# Altium schematic sheet mackenziemillerschem1.SchDoc
size Tabloid; SheetNumber: 1; SheetTotal: 1
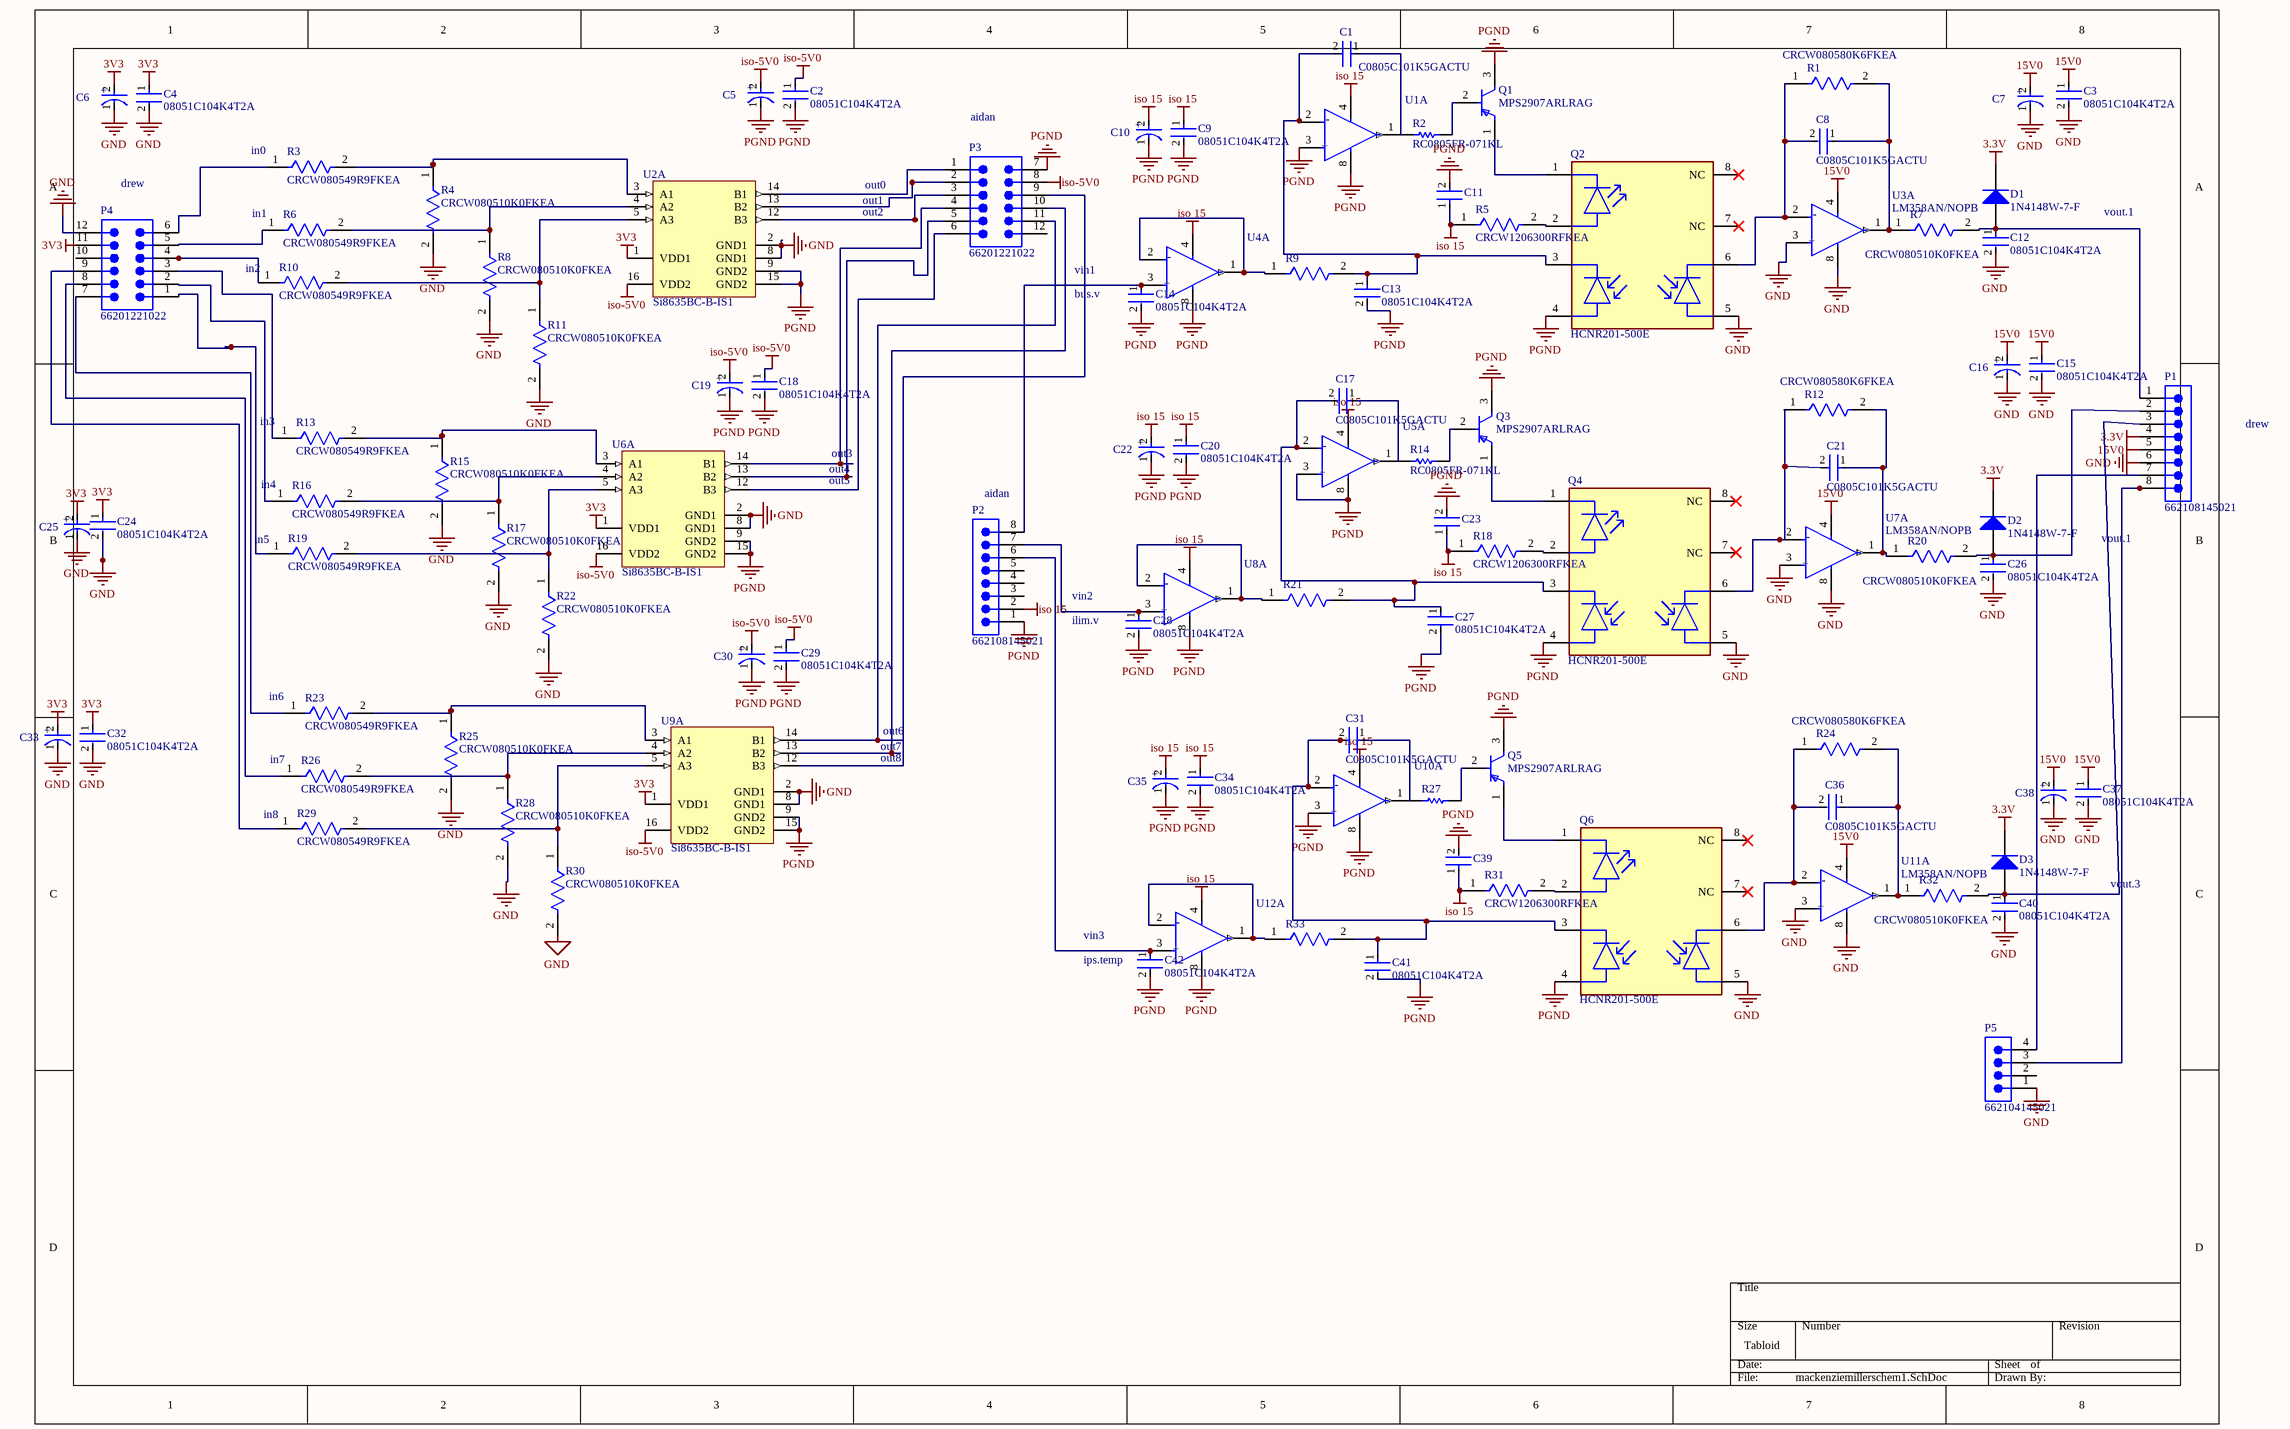
[diagram p0: mackenziemillerschem1.SchDoc]

## Parts
C1  C0805C101K5GACTU  [FP-C0805C-DN-MFG]
C2  08051C104K4T2A  [FP-0805-L_2_01_0_2-W_1_25-IPC_B]
C3  08051C104K4T2A  [FP-0805-L_2_01_0_2-W_1_25-IPC_B]
C4  08051C104K4T2A  [FP-0805-L_2_01_0_2-W_1_25-IPC_B]
C5  293D106X9010B2TE3  [FP-293DB-MFG]  (value not drawn)
C6  293D106X9010B2TE3  [FP-293DB-MFG]  (value not drawn)
C7  293D106X9010B2TE3  [FP-293DB-MFG]  (value not drawn)
C8  C0805C101K5GACTU  [FP-C0805C-DN-MFG]
C9  08051C104K4T2A  [FP-0805-L_2_01_0_2-W_1_25-IPC_B]
C10  293D106X9010B2TE3  [FP-293DB-MFG]  (value not drawn)
C11  08051C104K4T2A  [FP-0805-L_2_01_0_2-W_1_25-IPC_B]  (value not drawn)
C12  08051C104K4T2A  [FP-0805-L_2_01_0_2-W_1_25-IPC_B]
C13  08051C104K4T2A  [FP-0805-L_2_01_0_2-W_1_25-IPC_B]
C14  08051C104K4T2A  [FP-0805-L_2_01_0_2-W_1_25-IPC_B]
C15  08051C104K4T2A  [FP-0805-L_2_01_0_2-W_1_25-IPC_B]
C16  293D106X9010B2TE3  [FP-293DB-MFG]  (value not drawn)
C17  C0805C101K5GACTU  [FP-C0805C-DN-MFG]
C18  08051C104K4T2A  [FP-0805-L_2_01_0_2-W_1_25-IPC_B]
C19  293D106X9010B2TE3  [FP-293DB-MFG]  (value not drawn)
C20  08051C104K4T2A  [FP-0805-L_2_01_0_2-W_1_25-IPC_B]
C21  C0805C101K5GACTU  [FP-C0805C-DN-MFG]
C22  293D106X9010B2TE3  [FP-293DB-MFG]  (value not drawn)
C23  08051C104K4T2A  [FP-0805-L_2_01_0_2-W_1_25-IPC_B]  (value not drawn)
C24  08051C104K4T2A  [FP-0805-L_2_01_0_2-W_1_25-IPC_B]
C25  293D106X9010B2TE3  [FP-293DB-MFG]  (value not drawn)
C26  08051C104K4T2A  [FP-0805-L_2_01_0_2-W_1_25-IPC_B]
C27  08051C104K4T2A  [FP-0805-L_2_01_0_2-W_1_25-IPC_B]
C28  08051C104K4T2A  [FP-0805-L_2_01_0_2-W_1_25-IPC_B]
C29  08051C104K4T2A  [FP-0805-L_2_01_0_2-W_1_25-IPC_B]
C30  293D106X9010B2TE3  [FP-293DB-MFG]  (value not drawn)
C31  C0805C101K5GACTU  [FP-C0805C-DN-MFG]
C32  08051C104K4T2A  [FP-0805-L_2_01_0_2-W_1_25-IPC_B]
C33  293D106X9010B2TE3  [FP-293DB-MFG]  (value not drawn)
C34  08051C104K4T2A  [FP-0805-L_2_01_0_2-W_1_25-IPC_B]
C35  293D106X9010B2TE3  [FP-293DB-MFG]  (value not drawn)
C36  C0805C101K5GACTU  [FP-C0805C-DN-MFG]
C37  08051C104K4T2A  [FP-0805-L_2_01_0_2-W_1_25-IPC_B]
C38  293D106X9010B2TE3  [FP-293DB-MFG]  (value not drawn)
C39  08051C104K4T2A  [FP-0805-L_2_01_0_2-W_1_25-IPC_B]  (value not drawn)
C40  08051C104K4T2A  [FP-0805-L_2_01_0_2-W_1_25-IPC_B]
C41  08051C104K4T2A  [FP-0805-L_2_01_0_2-W_1_25-IPC_B]
C42  08051C104K4T2A  [FP-0805-L_2_01_0_2-W_1_25-IPC_B]
D1  1N4148W-7-F  [DIOD-SOD123-2_V]
D2  1N4148W-7-F  [DIOD-SOD123-2_V]
D3  1N4148W-7-F  [DIOD-SOD123-2_V]
P1  662108145021  [662108145021]
P2  662108145021  [662108145021]
P3  66201221022  [66201221022]
P4  66201221022  [66201221022]
P5  662104145021  [662104145021]
Q1  MPS2907ARLRAG  [FP-29-11-MFG]
Q2  HCNR201-500E  [FP-HCNR201-500E-MFG]
Q3  MPS2907ARLRAG  [FP-29-11-MFG]
Q4  HCNR201-500E  [FP-HCNR201-500E-MFG]
Q5  MPS2907ARLRAG  [FP-29-11-MFG]
Q6  HCNR201-500E  [FP-HCNR201-500E-MFG]
R1  CRCW080580K6FKEA  [FP-CRCW0805-e3-IPC_A]
R2  RC0805FR-071KL  [RESC2013X60X35ML10T20]
R3  CRCW080549R9FKEA  [FP-CRCW0805-e3-MFG]
R4  CRCW080510K0FKEA  [FP-CRCW0805-e3-IPC_A]
R5  CRCW1206300RFKEA  [FP-CRCW1206-e3-IPC_A]
R6  CRCW080549R9FKEA  [FP-CRCW0805-e3-MFG]
R7  CRCW080510K0FKEA  [FP-CRCW0805-e3-IPC_A]
R8  CRCW080510K0FKEA  [FP-CRCW0805-e3-IPC_A]
R9  CRCW080580K6FKEA  [FP-CRCW0805-e3-IPC_A]  (value not drawn)
R10  CRCW080549R9FKEA  [FP-CRCW0805-e3-MFG]
R11  CRCW080510K0FKEA  [FP-CRCW0805-e3-IPC_A]
R12  CRCW080580K6FKEA  [FP-CRCW0805-e3-IPC_A]
R13  CRCW080549R9FKEA  [FP-CRCW0805-e3-MFG]
R14  RC0805FR-071KL  [RESC2013X60X35ML10T20]
R15  CRCW080510K0FKEA  [FP-CRCW0805-e3-IPC_A]
R16  CRCW080549R9FKEA  [FP-CRCW0805-e3-MFG]
R17  CRCW080510K0FKEA  [FP-CRCW0805-e3-IPC_A]
R18  CRCW1206300RFKEA  [FP-CRCW1206-e3-IPC_A]
R19  CRCW080549R9FKEA  [FP-CRCW0805-e3-MFG]
R20  CRCW080510K0FKEA  [FP-CRCW0805-e3-IPC_A]
R21  CRCW080580K6FKEA  [FP-CRCW0805-e3-IPC_A]  (value not drawn)
R22  CRCW080510K0FKEA  [FP-CRCW0805-e3-IPC_A]
R23  CRCW080549R9FKEA  [FP-CRCW0805-e3-MFG]
R24  CRCW080580K6FKEA  [FP-CRCW0805-e3-IPC_A]
R25  CRCW080510K0FKEA  [FP-CRCW0805-e3-IPC_A]
R26  CRCW080549R9FKEA  [FP-CRCW0805-e3-MFG]
R27  RC0805FR-071KL  [RESC2013X60X35ML10T20]  (value not drawn)
R28  CRCW080510K0FKEA  [FP-CRCW0805-e3-IPC_A]
R29  CRCW080549R9FKEA  [FP-CRCW0805-e3-MFG]
R30  CRCW080510K0FKEA  [FP-CRCW0805-e3-IPC_A]
R31  CRCW1206300RFKEA  [FP-CRCW1206-e3-IPC_A]
R32  CRCW080510K0FKEA  [FP-CRCW0805-e3-IPC_A]
R33  CRCW080580K6FKEA  [FP-CRCW0805-e3-IPC_A]  (value not drawn)
U1  LM358AN/NOPB  [FP-P0008A-MFG]  (value not drawn)  (part A of 2)
U2  Si8635BC-B-IS1  [SLAB-SOIC-16-NB_L]  (part A of 2)
U3  LM358AN/NOPB  [FP-P0008A-MFG]  (part A of 2)
U4  LM358AN/NOPB  [FP-P0008A-MFG]  (value not drawn)  (part A of 2)
U5  LM358AN/NOPB  [FP-P0008A-MFG]  (value not drawn)  (part A of 2)
U6  Si8635BC-B-IS1  [SLAB-SOIC-16-NB_L]  (part A of 2)
U7  LM358AN/NOPB  [FP-P0008A-MFG]  (part A of 2)
U8  LM358AN/NOPB  [FP-P0008A-MFG]  (value not drawn)  (part A of 2)
U9  Si8635BC-B-IS1  [SLAB-SOIC-16-NB_L]  (part A of 2)
U10  LM358AN/NOPB  [FP-P0008A-MFG]  (value not drawn)  (part A of 2)
U11  LM358AN/NOPB  [FP-P0008A-MFG]  (part A of 2)
U12  LM358AN/NOPB  [FP-P0008A-MFG]  (value not drawn)  (part A of 2)

## Nets
3.3V: D1.2(K) D2.2(K) D3.2(K) P1.4
3V3: C4.1 C6.2(A) C24.1 C25.2(A) C32.1 C33.2(A) U2.1(VDD1) U6.1(VDD1) U9.1(VDD1)
15V0: C3.1 C7.2(A) C15.1 C16.2(A) C37.1 C38.2(A) P1.5 U3.4(GND) U7.4(GND) U11.4(GND)
GND: C3.2 C4.2 C6.1(C) C7.1(C) C12.2 C15.2 C16.1(C) C24.2 C25.1(C) C26.2 C32.2 C33.1(C) C37.2 C38.1(C) C40.2 P1.6 P4.12 P5.1 Q2.5(PD2_ANODE) Q4.5(PD2_ANODE) Q6.5(PD2_ANODE) R4.2 R8.2 R11.2 R15.2 R17.2 R22.2 R25.2 R28.2 R30.2 U2.2(GND1) U2.8(GND1) U3.3(NON-INVERTING_INPUT_A) U3.8(V+) U6.2(GND1) U6.8(GND1) U7.3(NON-INVERTING_INPUT_A) U7.8(V+) U9.2(GND1) U9.8(GND1) U11.3(NON-INVERTING_INPUT_A) U11.8(V+)
iso 15: C9.1 C10.2(A) C11.1 C20.1 C22.2(A) C23.1 C34.1 C35.2(A) C39.1 P2.2 R5.1 R18.1 R31.1 U1.4(GND) U4.4(GND) U5.4(GND) U8.4(GND) U10.4(GND) U12.4(GND)
iso-5V0: C2.1 C5.2(A) C18.1 C19.2(A) C29.1 C30.2(A) P3.8 U2.16(VDD2) U6.16(VDD2) U9.16(VDD2)
PGND: C2.2 C5.1(C) C9.2 C10.1(C) C11.2 C13.2 C14.2 C18.2 C19.1(C) C20.2 C22.1(C) C23.2 C27.2 C28.2 C29.2 C30.1(C) C34.2 C35.1(C) C39.2 C41.2 C42.2 P2.1 P3.7 Q1.3(C) Q2.4(PD1_ANODE) Q3.3(C) Q4.4(PD1_ANODE) Q5.3(C) Q6.4(PD1_ANODE) U1.3(NON-INVERTING_INPUT_A) U1.8(V+) U2.9(GND2) U2.15(GND2) U4.8(V+) U5.3(NON-INVERTING_INPUT_A) U5.8(V+) U6.9(GND2) U6.15(GND2) U8.8(V+) U9.9(GND2) U9.15(GND2) U10.3(NON-INVERTING_INPUT_A) U10.8(V+) U12.8(V+)
NetC1_1: C1.1 R2.1
NetC1_2: C1.2 C13.1 Q2.3(PD1_CATHODE) R9.2 U1.2(INVERTING_INPUT_A)
NetC8_1: C8.1 R1.2 R7.1 U3.1(OUTPUT_A)
NetC8_2: C8.2 Q2.6(PD2_CATHODE) R1.1 U3.2(INVERTING_INPUT_A)
NetC12_1: C12.1 D1.1(A) P1.1 R7.2
NetC14_1: C14.1 P2.8 U4.3(NON-INVERTING_INPUT_A)
NetC17_1: C17.1 R14.1
NetC17_2: C17.2 C27.1 Q4.3(PD1_CATHODE) R21.2 U5.2(INVERTING_INPUT_A)
NetC21_1: C21.1 R12.2 R20.1 U7.1(OUTPUT_A)
NetC21_2: C21.2 Q4.6(PD2_CATHODE) R12.1 U7.2(INVERTING_INPUT_A)
NetC26_1: C26.1 D2.1(A) P1.2 R20.2
NetC28_1: C28.1 P2.7 U8.3(NON-INVERTING_INPUT_A)
NetC31_1: C31.1 R27.1
NetC31_2: C31.2 C41.1 Q6.3(PD1_CATHODE) R33.2 U10.2(INVERTING_INPUT_A)
NetC36_1: C36.1 R24.2 R32.1 U11.1(OUTPUT_A)
NetC36_2: C36.2 Q6.6(PD2_CATHODE) R24.1 U11.2(INVERTING_INPUT_A)
NetC40_1: C40.1 D3.1(A) P1.3 R32.2
NetC42_1: C42.1 P2.6 U12.3(NON-INVERTING_INPUT_A)
NetP1_7: P1.7 P5.4
NetP1_8: P1.8 P5.3
NetP3_1: P3.1 U2.14(B1)
NetP3_2: P3.2 U2.13(B2)
NetP3_3: P3.3 U2.12(B3)
NetP3_4: P3.4 U6.14(B1)
NetP3_5: P3.5 U6.13(B2)
NetP3_6: P3.6 U6.12(B3)
NetP3_9: P3.9 U9.12(B3)
NetP3_10: P3.10 U9.13(B2)
NetP3_11: P3.11 U9.14(B1)
NetP4_1: P4.1 R19.1
NetP4_2: P4.2 R16.1
NetP4_3: P4.3 R13.1
NetP4_4: P4.4 R10.1
NetP4_5: P4.5 R6.1
NetP4_6: P4.6 R3.1
NetP4_7: P4.7 R23.1
NetP4_8: P4.8 R26.1
NetP4_9: P4.9 R29.1
NetQ1_1: Q1.1(E) Q2.1(LED_CATHODE)
NetQ1_2: Q1.2(B) R2.2
NetQ2_2: Q2.2(LED_ANODE) R5.2
NetQ3_1: Q3.1(E) Q4.1(LED_CATHODE)
NetQ3_2: Q3.2(B) R14.2
NetQ4_2: Q4.2(LED_ANODE) R18.2
NetQ5_1: Q5.1(E) Q6.1(LED_CATHODE)
NetQ5_2: Q5.2(B) R27.2
NetQ6_2: Q6.2(LED_ANODE) R31.2
NetR3_2: R3.2 R4.1 U2.3(A1)
NetR6_2: R6.2 R8.1 U2.4(A2)
NetR9_1: R9.1 U4.1(OUTPUT_A) U4.2(INVERTING_INPUT_A)
NetR10_2: R10.2 R11.1 U2.5(A3)
NetR13_2: R13.2 R15.1 U6.3(A1)
NetR16_2: R16.2 R17.1 U6.4(A2)
NetR19_2: R19.2 R22.1 U6.5(A3)
NetR21_1: R21.1 U8.1(OUTPUT_A) U8.2(INVERTING_INPUT_A)
NetR23_2: R23.2 R25.1 U9.3(A1)
NetR26_2: R26.2 R28.1 U9.4(A2)
NetR29_2: R29.2 R30.1 U9.5(A3)
NetR33_1: R33.1 U12.1(OUTPUT_A) U12.2(INVERTING_INPUT_A)

Not connected (* = marked no-connect by the designer): P2 3 4 5; P3 12; P4 10 11; P5 2; Q2 7(NC)* 8(NC)*; Q4 7(NC)* 8(NC)*; Q6 7(NC)* 8(NC)*; U1 1(OUTPUT_A); U5 1(OUTPUT_A); U10 1(OUTPUT_A)

## Notes on the sheet
- (near R3) in0
- (near P3) aidan
- (near P4) drew
- (near R6) in1
- out1
- out2
- out0
- vout.1
- (near R10) in2
- vin1
- (near C14) bus.v
- (near R13) in3
- out4
- out5
- out3
- drew
- (near R19) in5
- (near R16) in4
- (near P2) aidan
- vin2
- (near C28) ilim.v
- (near R23) in6
- out6
- (near R26) in7
- out7
- out8
- (near R29) in8
- vout.3
- vin3
- (near C42) ips.temp
- Labels drawn without touching a wire or pin: 3V3
- (in symbol CMP-02414-000013-1) +
- (in symbol CMP-04895-000025-1, part A) -; +

## Library data of the parts
C1 C8 C17 C21 C31 C36 = CMP-03020-021029-1: CAP CER 100PF 50V C0G/NP0 0805; Manufacturer: KEMET; Temperature Coefficient: 30ppm/°C; Material: Ceramic; Tolerance: 0.1; Temperature Characteristic: C0G; Capacitance: 100 pF; Category: Cap; Mouser Description: Multilayer Ceramic Capacitors MLCC - SMD/SMT 50volts 100pF C0G 10%; Device Class L2: Capacitors; ComponentLink2URL: https://content.kemet.com/datasheets/KEM_C1003_C0G_SMD.pdf; RoHS: TRUE; Temperature Range Low: -55°C; Ipc Land Pattern Name: CAPC200125X78; Temperature Range High: +125°C; Manufacturer Part Number: C0805C101K5GACTU; Voltage Rating: 50 V; Device Class L1: Passive Components; Lead Free: Yes; Value: 100 pF; Device Class L3: Ceramic Capacitors; Digikey Description: CAP CER 100PF 50V C0G/NP0 0805; Octopart: https://octopart.com/c0805c101k5gactu-kemet-109877; Temperature: -55°C to +125°C; Automotive: No; Height: 0.88mm; Package: C0805C-DN; ComponentLink2Description: Datasheet
C2-C4 C9 C11-C15 C18 C20 C23 C24 C26-C29 C32 C34 C37 C39-C42 = CMP-2007-04172-2: Automotive Ceramic Capacitor, 0805, 100nF, 10%, X7R, 15%, 100V; Voltage Rating (DC): 100V; Case Code (Metric): 2012; Mount: Surface Mount; Length: 2.01mm; Depth: 1.25mm; Lead Free: Lead Free; Ratings: AEC-Q200; Max Operating Temperature: 125°C; Tolerance: 10%; Case/Package: 0805; Width: 0.049inch; Package Quantity: 1; Thickness: 0.055inch; Construction: Flat; Min Operating Temperature: -55°C; REACH SVHC: No SVHC; Number of Pins: 2; Radiation Hardening: No; Capacitance: 100nF; Voltage Rating: 100V; Height: 1.4mm; Series: -; Voltage: 100V; Dielectric: X7R; Termination: SMD/SMT; Case Code (Imperial): 0805; RoHS Compliant: Yes; Packaging: Tape and Reel; Dielectric Material: Ceramic
C5-C7 C10 C16 C19 C22 C25 C30 C33 C35 C38 = CMP-02414-000013-1: CAP TANT 10UF 10% 10V 1411; Leakage Current: 1uA; Q Factor: 6; Ripple Current: 150mA; ESR (Equivalent Series Resistance): 2.5R; Polarity: Polar; Dissipation Factor: 6%; Dielectric Material: Tantalum; Package Quantity: 2000; Features: General Purpose; Voltage: 10V; Height: 1.9mm; Width: 1.9mm; Case Code (Imperial): 1411; Construction: Flat; Packaging: Tape and Reel; Min Operating Temperature: -55°C; RoHS Compliant: Yes; Lead Free: Lead Free; Mount: Surface Mount; Case Code (Metric): 3528; Capacitance: 10uF; Series: TANTAMOUNT®, 293D; Length: 3.5mm; Voltage Rating (DC): 10V; Max Operating Temperature: 125°C; Tolerance: 10%; Termination: SMD/SMT; Height - Seated (Max): 0.083inch; Case/Package: 1411; Voltage Rating: 10V; Radiation Hardening: No; Depth: 2.8mm
D1-D3 = CMP-2000-04932-2: Fast Switching Diode, 100 V, 0.15 A, -65 to 150 degC, 2-Pin?SOD123, RoHS, Tape and Reel; Recovery Time: 4ns; Brand: DiodesIncorporated; Unit Weight: 0.000353oz; Max Surge Current: 2A; Peak Reverse Voltage: 100V; Ir - Reverse Current: 1uA; Vf - Forward Voltage: 1.25V; Configuration: Single; If - Forward Current: 0.15A; Product Category: Diodes-GeneralPurpose,Power,Switching; Operating Temperature Range: -65Cto+150C; Packaging: Reel; Manufacturer URL: http://www.diodes.com/; Maximum Operating Temperature: +150C; Height: 1.25mm; Minimum Operating Temperature: -65C; Product: SwitchingDiodes; Package URL: http://www.diodes.com/datasheets/ds18004.pdf; Type: SwitchingDiode; Package Reference: SOD123-2; Width: 1.7mm; Datasheet URL: http://www.farnell.com/datasheets/1915529.pdf; Datasheet Version: Rev. 24-2, 10/2013; Series: 1N4148; Factory Pack Quantity: 3000; Length: 2.85mm; RoHS: True; Manufacturer: DiodesIncorporated; Mounting Style: SMD/SMT; Package / Case: SOD-123
P1 P2 = CMP-1502-00488-2: NexarPartId: 23024787; Insulation Resistance: 1GΩ; Current Rating: 5A; Number of Contacts: 8; Gender: Male; Operating Supply Voltage: 250V; Pitch: 3mm; Connector Type: Male Pin, Socket; Contact Resistance: 10mΩ; Contact Plating: Tin; RoHS: Compliant; Color: Black; Lead Pitch: 3mm; REACH SVHC: Unknown; Mount: Surface Mount; Max Operating Temperature: 105°C; Min Operating Temperature: -40°C; Length: 27.65mm; Fastening Type: Ramp; Height: 14mm; Number of Pins: 8; Number of Rows: 1; Width: 12.85mm; Packaging: Tape and Reel; Number of Positions: 8; Contact Material: Copper; Termination: Solder
P3 P4 = CMP-1502-00369-2: NexarPartId: 23024718; Row Spacing: 2.9972mm; Pitch: 3mm; Number of Positions: 12; Connector Type: Male Pin, Socket; Contact Resistance: 10mΩ; Current Rating: 5A; Insulation Resistance: 1GΩ; Gender: Male; Operating Supply Voltage: 250V; Number of Pins: 12; Contact Plating: Tin; Max Operating Temperature: 105°C; Fastening Type: Latch; Min Operating Temperature: -40°C; RoHS: Compliant; Number of Rows: 2; Number of Contacts: 12; Mount: Through Hole; Lead Pitch: 3mm; Width: 21.7mm; Color: Black; Length: 21.7mm; Height: 8.9mm; Contact Material: Copper; Termination: Solder; REACH SVHC: Unknown
P5 = CMP-1502-00484-2: NexarPartId: 23024783; Number of Contacts: 4; Connector Type: Male Pin, Socket; Insulation Resistance: 1GΩ; Contact Resistance: 10mΩ; Gender: Male; Operating Supply Voltage: 250V; Pitch: 3mm; Current Rating: 5A; Height: 14mm; Termination: Solder; RoHS: Compliant; Max Operating Temperature: 105°C; Width: 6.85mm; Number of Positions: 4; Lead Pitch: 3mm; Mount: Surface Mount; REACH SVHC: Unknown; Packaging: Tape and Reel; Contact Plating: Tin; Contact Material: Copper; Length: 15.65mm; Color: Black; Number of Pins: 4; Number of Rows: 1; Min Operating Temperature: -40°C; Fastening Type: Ramp
Q1 Q3 Q5 = CMP-1048-01537-2: Manufacturer Lifecycle Status: OBSOLETE; NexarPartId: 358202; Frequency: 200MHz; Number of Elements: 1; Max Power Dissipation: 625mW; Max Junction Temperature (Tj): 150°C; Voltage Rating (DC): -60V; Element Configuration: Single; Collector Emitter Saturation Voltage: -1.6V; Current Rating: -600mA; Max Collector Current: 600mA; Emitter Base Voltage (VEBO): -5V; Polarity: PNP; Max Breakdown Voltage: 60V; hFE Min: 75; Max Frequency: 200MHz; RoHS: Compliant; Height: 5.33mm; Max Operating Temperature: 150°C; Min Operating Temperature: -55°C; Collector Emitter Voltage (VCEO): -60V; Lifecycle Status: Obsolete; Power Dissipation: 625mW; Radiation Hardening: No; REACH SVHC: Unknown; Schedule B: 8541210080; Number of Pins: 3; Length: 5.2mm; Packaging: Cut Tape; Collector Emitter Breakdown Voltage: -60V; Width: 4.19mm; Case/Package: TO-92; Contact Plating: Copper, Silver, Tin; Lead Free: Lead Free; Collector Base Voltage (VCBO): -60V; Gain Bandwidth Product: 200MHz; Transition Frequency: 200MHz
Q2 Q4 Q6 = CMP-18400-000025-2: OPTOISO 5KV LINEAR PHVOLT 8DIPGW; Number of Channels: 1; Power Dissipation: 60mW; Forward Current: 25mA; Reverse Voltage (DC): 2.5V; Output Voltage: 15V; Current Transfer Ratio: 0.72%; Forward Voltage: 1.6V; Input Type: DC; Input Current: 20mA; Packaging: Tape and Reel; Number of Elements: 1; Mount: Surface Mount; Isolation Voltage-Max: 5kV; REACH SVHC: No SVHC; Package Quantity: 1; Radiation Hardening: No; Max Power Dissipation: 60mW; Max Input Current: 25mA; Lead Free: Lead Free; Series: -; Max Operating Temperature: 100°C; Isolation Voltage: 5kV; Number of Pins: 8; RoHS Compliant: Yes; Contact Plating: Tin; Min Operating Temperature: -55°C; Case/Package: SMD/SMT; Reverse Breakdown Voltage: 2.5V
R1 R9 R12 R21 R24 R33 = CMP-2001-04127-2: RES Thick Film, 80.6kΩ, 1%, 0.125W, 100ppm/°C, 0805; Power Rating: 125mW; Voltage Rating: 150V; Resistance: 80.6kR; Tolerance: 1%; Min Operating Temperature: -55°C; Number of Pins: 2; Max Power Dissipation: 125mW; Radiation Hardening: No; Max Operating Temperature: 155°C; Composition: Thick Film; Temperature Coefficient: 100ppm/°C; Width: 1.25mm; Length: 2mm; Case Code (Metric): 2012; Packaging: Tape and Reel; Contact Plating: Tin; Termination: Solder; Case/Package: 0805; Features: Automotive AEC-Q200; Number of Terminations: 2; Military Standard: Not; Weight: 0.000194oz; Case Code (Imperial): 0805; Depth: 1.25mm; Lead Free: Lead Free; Package Quantity: 10; Height: 0.45mm; Voltage Rating (DC): 150V
R2 R14 R27 = CMP-2100-03671-1: Chip Resistor, 1 KOhm, +/- 1%, 125 mW, -55 to 155 degC, 0805 (2012 Metric), RoHS, Tape and Reel; Manufacturer: Yageo; Temperature Coefficient: 100ppm/degreesC; Voltage Rating (DC): 150V; Max Power Dissipation: 125mW; Resistance: 1KOhm; Number of Pins: 2; Number of Terminations: 2; Datasheet URL: http://www.yageo.com/NewPortal/yageodocoutput?fileName=/pdf/R-Chip/PYu-RC_Group_51_RoHS_L_5.pdf; Length: 0.079inch; Package Description: 2-Pin Surface Mounted Device, Body 2 x 1.25 mm; Depth: 1.25mm; Height: 0.024inch; Military Standard: Not; Case/Package: 0805; Package Reference: 0805; RoHSCompliant: true; Lead Free: LeadFree; Packaging: TapeandReel; Package Quantity: 1; Datasheet Version: Rev. 5, 10/2016; Tolerance: 1%; Min Operating Temperature: -55degC; Voltage Rating: 150V; Composition: ThickFilm; Case Code (Imperial): 0805; Power Rating: 125mW; Width: 0.049inch; Case Code (Metric): 2012; Manufacturer URL: http://www.yageo.com/; Max Operating Temperature: 155degC; REACH SVHC: Unknown; Termination: SMD/SMT
R3 R6 R10 R13 R16 R19 R23 R26 R29 = CMP-2001-03954-2: RES Thick Film, 49.9Ω, 1%, 0.125W, 100ppm/°C, 0805; Resistance: 49.9R; Voltage Rating: 150V; Max Power Dissipation: 125mW; Case Code (Metric): 2012; Termination: SMD/SMT; Min Operating Temperature: -55°C; Tolerance: 1%; Weight: 0.000194oz; Features: Automotive AEC-Q200; Length: 2mm; Contact Plating: Tin; Package Quantity: 10; Temperature Coefficient: 100ppm/°C; Max Operating Temperature: 155°C; Height: 0.45mm; Composition: Thick Film; Power Rating: 125mW; Number of Terminations: 2; Case/Package: 0805; Lead Free: Lead Free; Case Code (Imperial): 0805; Packaging: Tape and Reel; Width: 1.25mm; Voltage Rating (DC): 150V; Military Standard: Not; Depth: 1.25mm
R4 R7 R8 R11 R15 R17 R20 R22 R25 R28 R30 R32 = CMP-2001-04908-2: RES Thick Film, 10kΩ, 1%, 0.125W, 100ppm/°C, 0805; Resistance: 10kR; Voltage Rating (DC): 150V; Power Rating: 125mW; Weight: 0.000194oz; Package Quantity: 5000; Military Standard: Not; Max Operating Temperature: 155°C; Temperature Coefficient: 100ppm/°C; Contact Plating: Tin; Width: 1.25mm; Height: 0.45mm; Radiation Hardening: No; Tolerance: 1%; Min Operating Temperature: -55°C; Voltage Rating: 150V; Length: 2mm; Depth: 1.25mm; Termination: SMD/SMT; Packaging: Tape and Reel; Case/Package: 0805; Case Code (Metric): 2012; Lead Free: Lead Free; Case Code (Imperial): 0805; Composition: Thick Film
R5 R18 R31 = CMP-1014-00449-3: RES Thick Film, 300Ω, 1%, 0.25W, 100ppm/°C, 1206; Voltage Rating (DC): 200V; Power Rating: 250mW; Resistance: 300R; Number of Terminations: 2; Weight: 0.000353oz; Max Operating Temperature: 155°C; Features: Automotive AEC-Q200; Min Operating Temperature: -55°C; Case Code (Imperial): 1206; Voltage Rating: 200V; Termination: SMD/SMT; Military Standard: Not; Composition: Thick Film; Tolerance: 1%; Mount: Surface Mount; Package Quantity: 10; Length: 3.2mm; Depth: 1.6mm; Temperature Coefficient: 100ppm/°C; Width: 0.063inch; Contact Plating: Tin; Lead Free: Lead Free; Case Code (Metric): 3216; Radiation Hardening: No; Max Power Dissipation: 250mW; Working Voltage: 200V; Packaging: Tape and Reel; Height: 0.55mm; Case/Package: 1206
U1 U3-U5 U7 U8 U10-U12 = CMP-04895-000025-1: IC OPAMP GP 2 CIRCUIT 8DIP; Manufacturer: Texas Instruments; Max Supply Voltage: 32V; Input Bias Current: 0.045uA; Nominal Supply Current: 0.5-1mA; Min Supply Voltage: 3V; Voltage Gain: 100V/mV; Standoff Height: 0.51mm; Number Of Channels: 2; Max Dual Supply Voltage: 16V; Input Offset Voltage: 2mV; Output Current Per Channel: 20mA; Min Dual Supply Voltage: 1.5V; Gain Bandwidth: 1MHz; Automotive: No; Device Class L2: Linear ICs; Device Class L1: Integrated Circuits (ICs); ComponentLink2URL: http://www.ti.com/lit/ds/symlink/lm358-n.pdf; Temperature Range Low: 0°C; Mouser Description: Operational Amplifiers - Op Amps LOW PWR DUAL OP AMP; Lead Free: Yes; Height: 5.08mm; Category: IC; Ipc Land Pattern Name: DIP794W46P254L1016H508Q8; Temperature: 0°C to +70°C; RoHS: TRUE; Temperature Range High: +70°C; Package: P0008A; Digikey Description: IC OPAMP GP 2 CIRCUIT 8DIP; ComponentLink2Description: Datasheet; Manufacturer Part Number: LM358AN/NOPB; Octopart: https://octopart.com/lm358an%2Fnopb-texas+instruments-24814014; Device Class L3: Amplifiers - Op Amps
U2 U6 U9 = CMP-0512-00173-1: Low-Power Triple-Channel Digital Isolator, 150 Mbps, 3.75 kVRMS Isolation Rating, -40 to 125 degC, 16-pin SOIC; Manufacturer: Silicon Labs; Maximum Propagation Delay (ns): 13; Maximum Data Rate (Mbps): 150; Channel Type: Unidirectional; Isolation Rating (kV): 3.75; 10kV surge: FALSE; Sub-Family: Isolators; AEC-Q100: TRUE; Mounting Technology: Surface Mount; PackageReference: SOIC-16-NB; Code_JEDEC: MS-012; ComponentLink2URL: http://www.silabs.com/Support%20Documents/TechnicalDocs/Si863x.pdf; Code_IPC: J-STD-020; ComponentLink2Description: Datasheet; PartNumber: Si8635BC-B-IS1; PackageDescription: 16-Pin Small-Outline Integrated Circuit, Body 9.9 x 3.9 mm, Pitch 1.27 mm; Enable Control: TRUE; DatasheetVersion: Rev. 1.3; ComponentLink3Description: Package Specification; ComponentLink1Description: Manufacturer URL; ComponentLink3URL: http://www.silabs.com/Support%20Documents/TechnicalDocs/si2401.pdf; ComponentLink1URL: http://www.silabs.com/